# EasyEDA Pro project Nudge.eprj

# Schematic EMGTest1
Board Name: Board1; Create Date: 2026-07-14; Page Name: P1; Project Name: Nudge; Schematic Name: EMGTest1; Update Date: 2026-07-15; Company: EasyEDA.com; Page Size: A4; Version: V1.0
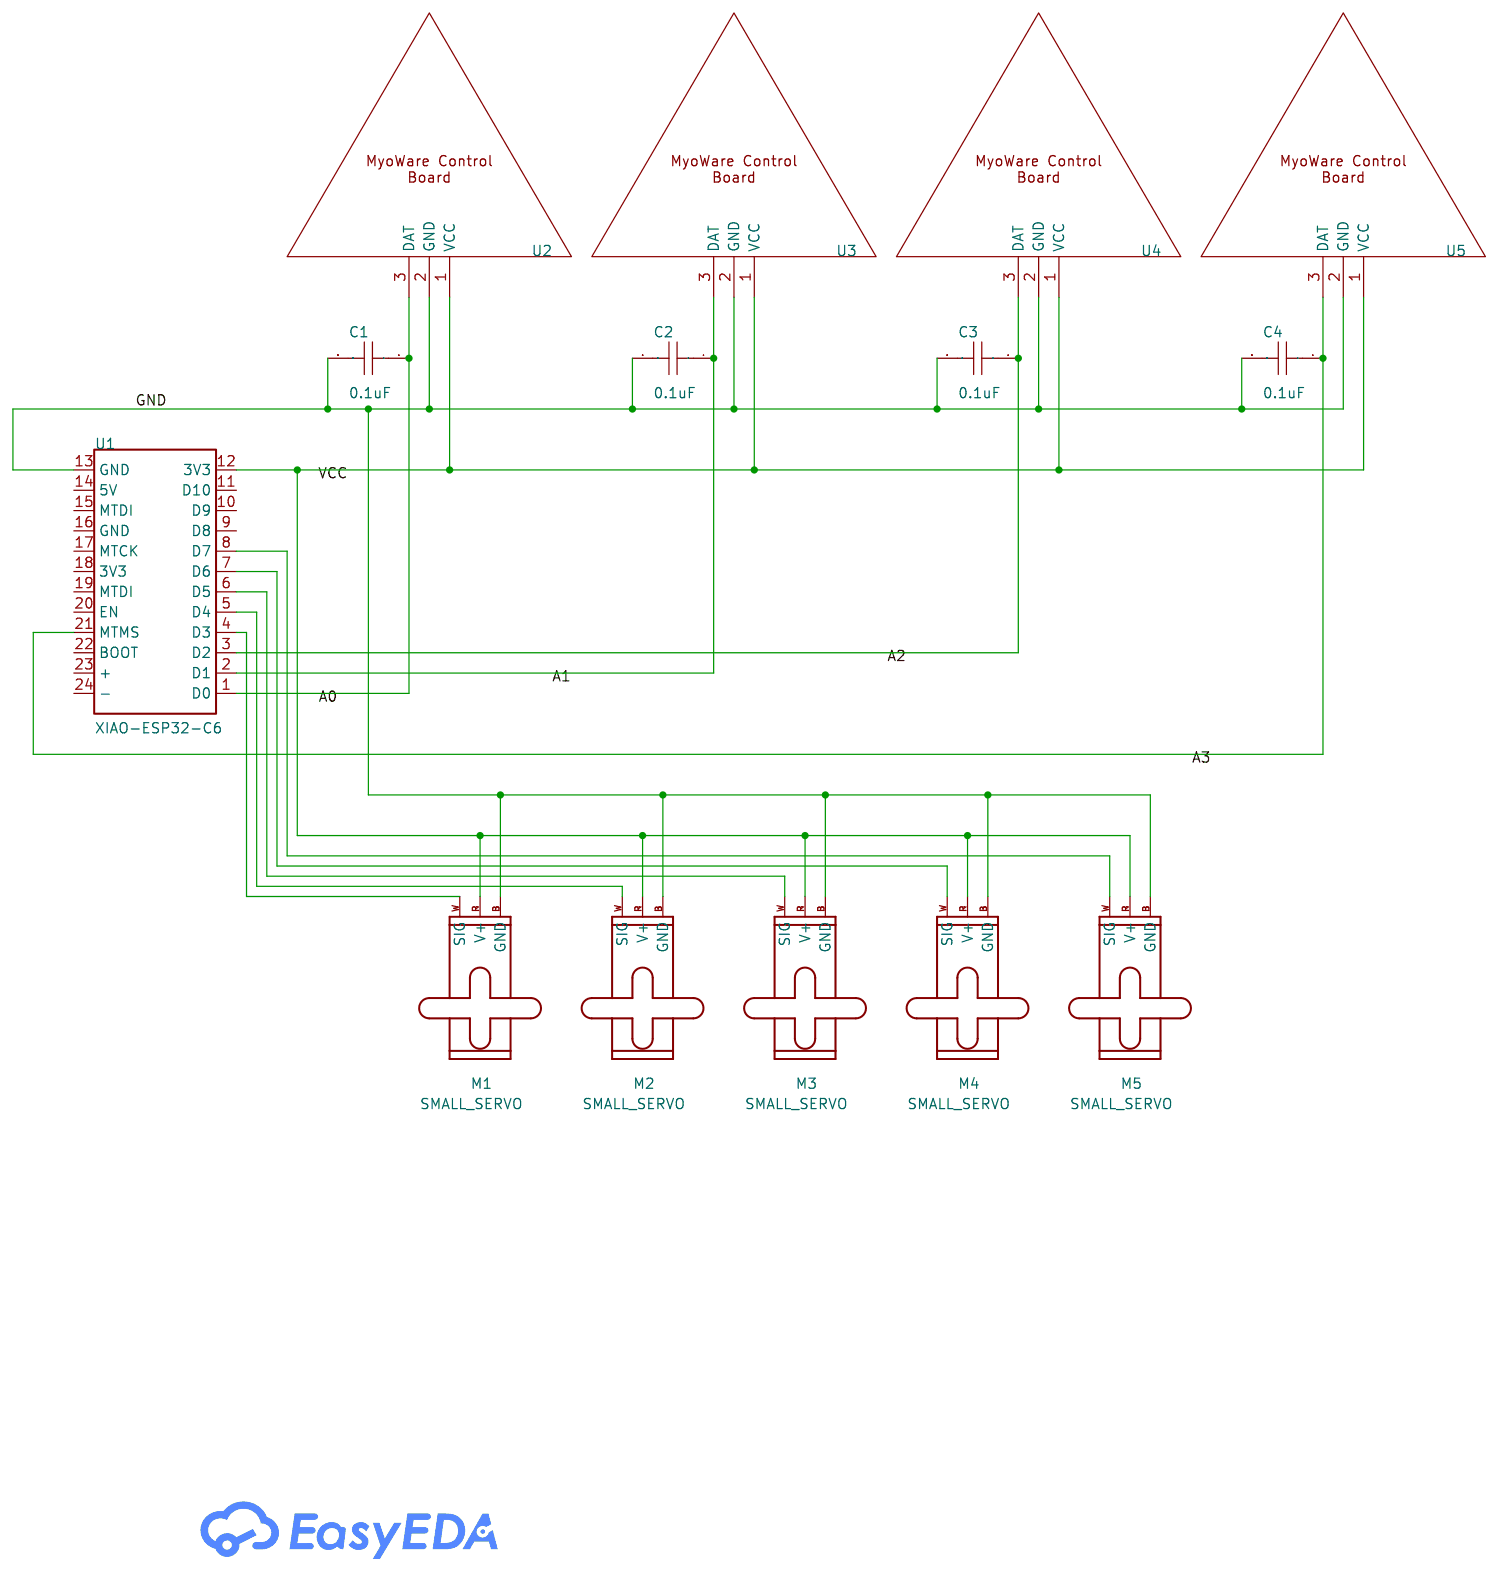
[diagram p0: schematic sheet]

## Parts
C1  0.1uF  [C0603]
C2  0.1uF  [C0603]
C3  0.1uF  [C0603]
C4  0.1uF  [C0603]
M1  SMALL_SERVO
M2  SMALL_SERVO
M3  SMALL_SERVO
M4  SMALL_SERVO
M5  SMALL_SERVO
U1  XIAO-ESP32-C6
U2  -
U3  -
U4  -
U5  -

## Library data of the parts
C1-C4 = CAP_0603: Supplier Footprint: 0603
M1-M5 = SMALL_SERVO
U1 = XIAO-ESP32-C6: Supplier: LCSC; Supplier Part: C9900124963; Manufacturer: null; JLCPCB Part Class: Extended Part
U2-U5 = MyoWare Board

## Nets
GND: C1.2 C2.2 C3.2 C4.2 M1.3(GND) M2.3(GND) M3.3(GND) M4.3(GND) M5.3(GND) U1.13(GND) U2.2(GND) U3.2(GND) U4.2(GND) U5.2(GND)
VCC: M1.2(V+) M2.2(V+) M3.2(V+) M4.2(V+) M5.2(V+) U1.12(3V3) U2.1(VCC) U3.1(VCC) U4.1(VCC) U5.1(VCC)
A0: C1.1 U1.1(D0) U2.3(DAT)
A1: C2.1 U1.2(D1) U3.3(DAT)
A2: C3.1 U1.3(D2) U4.3(DAT)
A3: C4.1 U1.21(MTMS) U5.3(DAT)
Net-(M1-1): M1.1(SIG) U1.4(D3)
Net-(M2-1): M2.1(SIG) U1.5(D4)
Net-(M3-1): M3.1(SIG) U1.6(D5)
Net-(M4-1): M4.1(SIG) U1.7(D6)
Net-(M5-1): M5.1(SIG) U1.8(D7)

Not connected (* = marked no-connect by the designer): U1 9(D8) 10(D9) 11(D10) 14(5V) 15(MTDI) 16(GND) 17(MTCK) 18(3V3) 19(MTDI) 20(EN) 22(BOOT) 23(+) 24(-)
